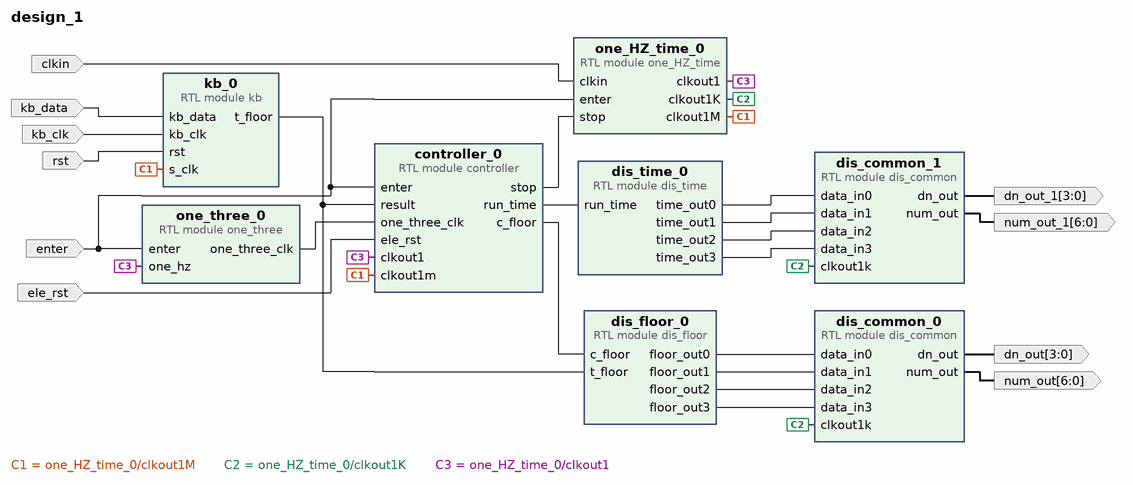
[diagram p0: block diagram of the top level]
# Vivado block design design_1, xc7a35tcsg324-3, Vivado 2017.1
create_bd_design design_1

create_bd_port -dir I -type clk clkin
set_property -dict {CONFIG.FREQ_HZ 100000000} [get_bd_ports clkin]
create_bd_port -dir O -from 6 -to 0 num_out
create_bd_port -dir O -from 3 -to 0 dn_out
create_bd_port -dir O -from 6 -to 0 num_out_1
create_bd_port -dir O -from 3 -to 0 dn_out_1
create_bd_port -dir I kb_data
create_bd_port -dir I -type clk kb_clk
set_property -dict {CONFIG.FREQ_HZ 100000000} [get_bd_ports kb_clk]
create_bd_port -dir I -type rst rst
create_bd_port -dir I -type rst ele_rst
create_bd_port -dir I enter

create_bd_cell -type module -reference dis_time dis_time_0
create_bd_cell -type module -reference controller controller_0
create_bd_cell -type module -reference dis_common dis_common_0
create_bd_cell -type module -reference dis_common dis_common_1
create_bd_cell -type module -reference dis_floor dis_floor_0
create_bd_cell -type module -reference one_HZ_time one_HZ_time_0
create_bd_cell -type module -reference one_three one_three_0
create_bd_cell -type module -reference kb kb_0

# ---- connections ----

connect_bd_net [get_bd_ports clkin] [get_bd_pins one_HZ_time_0/clkin]
connect_bd_net [get_bd_pins dis_common_0/num_out] [get_bd_ports num_out]
connect_bd_net [get_bd_pins dis_common_0/dn_out] [get_bd_ports dn_out]
connect_bd_net [get_bd_pins dis_common_1/num_out] [get_bd_ports num_out_1]
connect_bd_net [get_bd_pins dis_common_1/dn_out] [get_bd_ports dn_out_1]
connect_bd_net [get_bd_pins one_three_0/one_three_clk] [get_bd_pins controller_0/one_three_clk]
connect_bd_net [get_bd_pins one_HZ_time_0/clkout1M] [get_bd_pins controller_0/clkout1m] [get_bd_pins kb_0/s_clk]
connect_bd_net [get_bd_pins kb_0/t_floor] [get_bd_pins controller_0/result] [get_bd_pins dis_floor_0/t_floor]
connect_bd_net [get_bd_pins controller_0/c_floor] [get_bd_pins dis_floor_0/c_floor]
connect_bd_net [get_bd_ports kb_data] [get_bd_pins kb_0/kb_data]
connect_bd_net [get_bd_ports kb_clk] [get_bd_pins kb_0/kb_clk]
connect_bd_net [get_bd_ports rst] [get_bd_pins kb_0/rst]
connect_bd_net [get_bd_pins controller_0/stop] [get_bd_pins one_HZ_time_0/stop]
connect_bd_net [get_bd_pins controller_0/run_time] [get_bd_pins dis_time_0/run_time]
connect_bd_net [get_bd_ports ele_rst] [get_bd_pins controller_0/ele_rst]
connect_bd_net [get_bd_pins one_HZ_time_0/clkout1K] [get_bd_pins dis_common_0/clkout1k] [get_bd_pins dis_common_1/clkout1k]
connect_bd_net [get_bd_pins one_HZ_time_0/clkout1] [get_bd_pins controller_0/clkout1] [get_bd_pins one_three_0/one_hz]
connect_bd_net [get_bd_ports enter] [get_bd_pins controller_0/enter] [get_bd_pins one_HZ_time_0/enter] [get_bd_pins one_three_0/enter]
connect_bd_net [get_bd_pins dis_time_0/time_out0] [get_bd_pins dis_common_1/data_in0]
connect_bd_net [get_bd_pins dis_time_0/time_out1] [get_bd_pins dis_common_1/data_in1]
connect_bd_net [get_bd_pins dis_time_0/time_out2] [get_bd_pins dis_common_1/data_in2]
connect_bd_net [get_bd_pins dis_time_0/time_out3] [get_bd_pins dis_common_1/data_in3]
connect_bd_net [get_bd_pins dis_floor_0/floor_out0] [get_bd_pins dis_common_0/data_in0]
connect_bd_net [get_bd_pins dis_floor_0/floor_out1] [get_bd_pins dis_common_0/data_in1]
connect_bd_net [get_bd_pins dis_floor_0/floor_out2] [get_bd_pins dis_common_0/data_in2]
connect_bd_net [get_bd_pins dis_floor_0/floor_out3] [get_bd_pins dis_common_0/data_in3]

validate_bd_design
save_bd_design
